# EAGLE design SerialRF1_SMD (EAGLE 7.1.0)
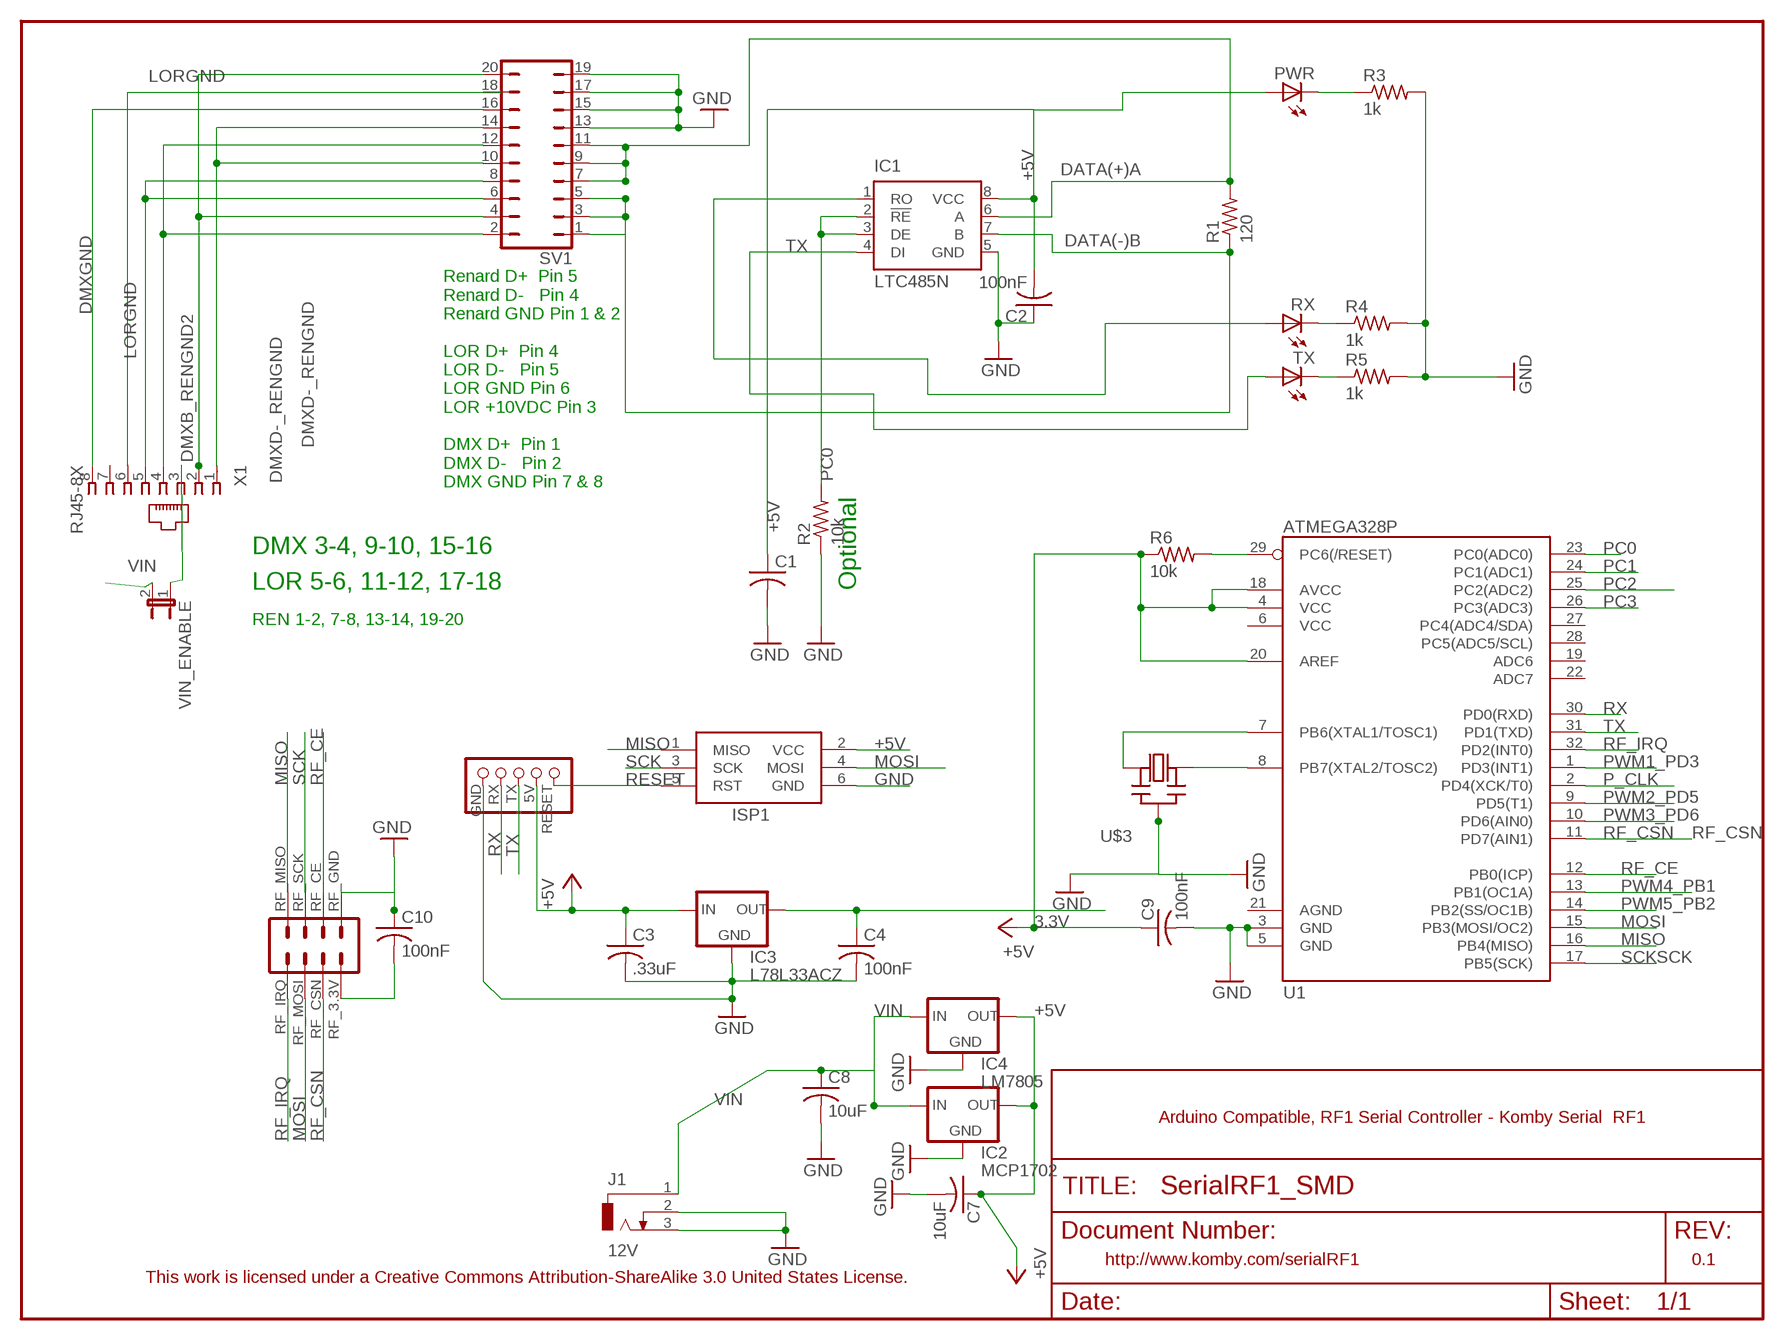
[diagram p0: schematic, sheet 1]

## Parts
C1  C-USC0805K  [C0805K]
C2  100nF  C-USC0805K  [C0805K]
C3  .33uF  C-USC0805K  [C0805K]
C4  100nF  C-USC0805K  [C0805K]
C7  10uF  C-USC0805K  [C0805K]
C8  10uF  C-USC0805K  [C0805K]
C9  100nF  C-USC0805K  [C0805K]
C10  100nF  C-USC0805K  [C0805K]
IC1  LTC485N  [DIL08]
IC2  MCP1702  MCP1700TRI  [TO92]
IC3  L78L33ACZ  78LXX  [78LXX]
IC4  LM7805  V_REG_78XXSINK  [TO220-IGO]
ISP1  AVRISP-6  [AVRISP]
J1  12V  DCJ0303  [DCJ0303]
PWR  LEDSML0805  [SML0805]
R1  120  R-US_R0805W  [R0805W]
R2  10k  R-US_R0805W  [R0805W]
R3  1k  R-US_M0805  [M0805]
R4  1k  R-US_M0805  [M0805]
R5  1k  R-US_M0805  [M0805]
R6  10k  R-US_R0805  [R0805]
RX  LEDSML0805  [SML0805]
SV1  JP10Q  [JP10Q]
TX  LEDSML0805  [SML0805]
U1  ATMEGA328P  ATMEGA328_SMT  [TQFP32-08]
U$3  CERMOSCILL-THM  [CERM_OSC]
U$4  KOMBY_TTL_SERIAL  [KOMBY_SERIAL_FOOTPRINT]
U$6  NRF24L01_HEADER  [NRF24L01]
VIN_ENABLE  JP1E  [JP1]
X1  RJ45-8X  [RJ45-NO-SHIELD]

## Nets
3.3V: C4.1 IC3.OUT
+5V: C1.1 C2.2 C3.1 C7.1 C9.1 IC1.8(VCC) IC2.3(OUT) IC3.IN IC4.OUT ISP1.2(VCC) PWR.A R6.1 U1.4(VCC) U1.18(AVCC) U1.20(AREF) U$4.5V
DATA(+)A: IC1.6(A) R1.2 SV1.7 SV1.9 SV1.11
DATA(-)B: IC1.7(B) R1.1 SV1.1 SV1.3 SV1.5
DMXB_RENGND2: SV1.4 SV1.20 X1.2
DMXD-_RENGND: SV1.10 SV1.14 X1.1
DMXGND: SV1.16 X1.8
GND: C1.2 C2.1 C3.2 C4.2 C7.2 C8.2 C9.2 C10.1 IC1.5(GND) IC2.1(GND) IC3.GND IC4.GND ISP1.6(GND) J1.2 J1.3 R2.1 R3.2 R4.2 R5.2 SV1.13 SV1.15 SV1.17 SV1.19 U1.3(GND) U1.5(GND) U$3.P$2(GND) U$4.GND U$6.RF_GND(RFGND_1)
LORGND: SV1.18 X1.6
MISO: ISP1.1(MISO) U1.16(PB4(MISO)) U$6.RF_MISO
MOSI: ISP1.4(MOSI) U1.15(PB3(MOSI/OC2)) U$6.RF_MOSI
N$1: SV1.6 SV1.8 X1.5
N$3: SV1.2 SV1.12 X1.4
N$5: VIN_ENABLE.1 X1.3
N$7: PWR.C R3.1
N$8: R4.1 RX.C
N$9: R5.1 TX.C
N$10: U1.8(PB7(XTAL2/TOSC2)) U$3.P$3(OUT)
N$11: U1.7(PB6(XTAL1/TOSC1)) U$3.P$1(IN)
N$14: C10.2 U$6.RF_3.3V
P_CLK: U1.2(PD4(XCK/T0))
PC0: IC1.2(!RE) IC1.3(DE) R2.2 U1.23(PC0(ADC0))
PC1: U1.24(PC1(ADC1))
PC2: U1.25(PC2(ADC2))
PC3: U1.26(PC3(ADC3))
PWM1_PD3: U1.1(PD3(INT1))
PWM2_PD5: U1.9(PD5(T1))
PWM3_PD6: U1.10(PD6(AIN0))
PWM4_PB1: U1.13(PB1(OC1A))
PWM5_PB2: U1.14(PB2(SS/OC1B))
RESET: ISP1.5(RST) R6.2 U1.29(PC6(/RESET)) U$4.RESET
RF_CE: U1.12(PB0(ICP)) U$6.RF_CE
RF_CSN: U1.11(PD7(AIN1)) U$6.RF_CSN
RF_IRQ: U1.32(PD2(INT0)) U$6.RF_IRQ
RX: IC1.1(RO) RX.A U1.30(PD0(RXD)) U$4.RX
SCK: ISP1.3(SCK) U1.17(PB5(SCK)) U$6.RF_SCK
TX: IC1.4(DI) TX.A U1.31(PD1(TXD)) U$4.TX
VIN: C8.1 IC2.2(IN) IC4.IN J1.1 VIN_ENABLE.2
Unconnected: U1.6(VCC) U1.19(ADC6) U1.21(AGND) U1.22(ADC7) U1.27(PC4(ADC4/SDA)) U1.28(PC5(ADC5/SCL)) X1.7

## Notes on the sheet
- Renard D+  Pin 5
  Renard D-   Pin 4
  Renard GND Pin 1 & 2
  
  LOR D+  Pin 4
  LOR D-   Pin 5
  LOR GND Pin 6
  LOR +10VDC Pin 3
  
  DMX D+  Pin 1
  DMX D-   Pin 2
  DMX GND Pin 7 & 8
- DMX 3-4, 9-10, 15-16
- LOR 5-6, 11-12, 17-18 | Optional
- REN 1-2, 7-8, 13-14, 19-20
- Arduino Compatible, RF1 Serial Controller - Komby Serial  RF1
- http://www.komby.com/serialRF1 | 0.1
- This work is licensed under a Creative Commons Attribution-ShareAlike 3.0 United States License.

## Library data of the parts
C1-C4 C7-C10 = adafruit:C-US: CAPACITOR, American symbol
IC1 = linear-technology:LTC485: Low Power RS485 Interface Transceiver Source: http://www.linear.com/pc/downloadDocument.do?navId=H0,C1,C1007,C1017,P2064,D1718; OC_FARNELL: unknown; OC_NEWARK: unknown
IC2 = adafruit:MCP1700: VOLTAGE REGULATOR
IC3 = v-reg:78LXX: VOLTAGE REGULATOR
IC4 = SparkFun-PowerIC:V_REG_78XX: Voltage Regulator Standard 7805 5V regulator. IGO (Input Ground Output). Spark Fun Electronics SKU : COM-00107
ISP1 = adafruit:AVRISP: AVR ISP HEADER Standard 6 pin header for AVR programming
J1 = con-jack_komby:DCJ0303: DC POWER JACK Source: DCJ0303.pdf; OC_FARNELL: unknown; OC_NEWARK: unknown
PWR RX TX = led:LED: LED OSRAM: - CHIPLED LG R971, LG N971, LY N971, LG Q971, LY Q971, LO R971, LY R971 LH N974, LH R974 LS Q976, LO Q976, LY Q976 LO Q996 - Hyper CHIPLED LW Q18S LB Q993, LB Q99A, LB R99A - SideLED LS A670, LO A670, LY A670, LG A670, LP A670 LB A673, LV A673, LT A673, LW A673 LH A674 LY A675 LS A676, LA A676, LO A676, LY A676, LW A676 LS A679, LY A679, LG A679 - Hyper Micro SIDELED® LS Y876, LA Y876, LO Y876, LY Y876 LT Y87S - SmartLED LW L88C, LW L88S LB L89C, LB L89S, LG L890 LS L89K, LO L89K, LY L89K LS L896, LA L896, LO L896, LY L896 - TOPLED LS T670, LO T670, LY T670, LG T670, LP T670 LSG T670, LSP T670, LSY T670, LOP T670, LYG T670 LG T671, LOG T671, LSG T671 LB T673, LV T673, LT T673, LW T673 LH T674 LS T676, LA T676, LO T676, LY T676, LB T676, LH T676, LSB T676, LW T676 LB T67C, LV T67C, LT T67C, LS T67K, LO T67K, LY T67K, LW E67C LS E67B, LA E67B, LO E67B, LY E67B, LB E67C, LV E67C, LT E67C LW T67C LS T679, LY T679, LG T679 LS T770, LO T770, LY T770, LG T770, LP T770 LB T773, LV T773, LT T773, LW T773 LH T774 LS E675, LA E675, LY E675, LS T675 LS T776, LA T776, LO T776, LY T776, LB T776 LHGB T686 LT T68C, LB T68C - Hyper Mini TOPLED® LB M676 - Mini TOPLED Santana® LG M470 LS M47K, LO M47K, LY M47K Source: http://www.osram.convergy.de LUXEON: - LUMILED® LXK2-PW12-R00, LXK2-PW12-S00, LXK2-PW14-U00, LXK2-PW14-V00 LXK2-PM12-R00, LXK2-PM12-S00, LXK2-PM14-U00 LXK2-PE12-Q00, LXK2-PE12-R00, LXK2-PE12-S00, LXK2-PE14-T00, LXK2-PE14-U00 LXK2-PB12-K00, LXK2-PB12-L00, LXK2-PB12-M00, LXK2-PB14-N00, LXK2-PB14-P00, LXK2-PB14-Q00 LXK2-PR12-L00, LXK2-PR12-M00, LXK2-PR14-Q00, LXK2-PR14-R00 LXK2-PD12-Q00, LXK2-PD12-R00, LXK2-PD12-S00 LXK2-PH12-R00, LXK2-PH12-S00 LXK2-PL12-P00, LXK2-PL12-Q00, LXK2-PL12-R00 Source: www.luxeon.com KINGBRIGHT: KA-3528ASYC Source: www.kingbright.com
R1-R6 = adafruit:R-US_: RESISTOR, American symbol
SV1 = jumper:JP10Q: JUMPER
U1 = SparkFun-DigitalIC:ATMEGA328_SMT: 32-Pin Atmega328 part Commonly used on Arduino compatible boards Available in QFP and QFN packages TQFP is IC-09069 QFN is non-stock; PROD_ID: IC-09069
U$3 = adafruit:CERMOSCILL: Ceramic oscillator with built in capacitors such as ZTT-12MHz http://www.ladyada.net/library/eagle
U$4 = komby1:KOMBY_TTL_SERIAL
U$6 = komby1:NRF24L01_HEADER: Header for the NRF24L01 8 Pin Transceivers. http://www.komby.com
VIN_ENABLE = jumper:JP1E: JUMPER
X1 = con-tycoelectronics_komby:RJ45: CORCOM Modular RJ Jacks No Shield Source: www.tycoelectronics.com .. ENG_DS_1654001_1099_RJ_L_0507.pdf; MPN: RJ45-8X; OC_FARNELL: unknown; OC_NEWARK: 16R6101

## Net classes
0 default: width 0.203 mm
1 vcc: width 0.305 mm

## Board
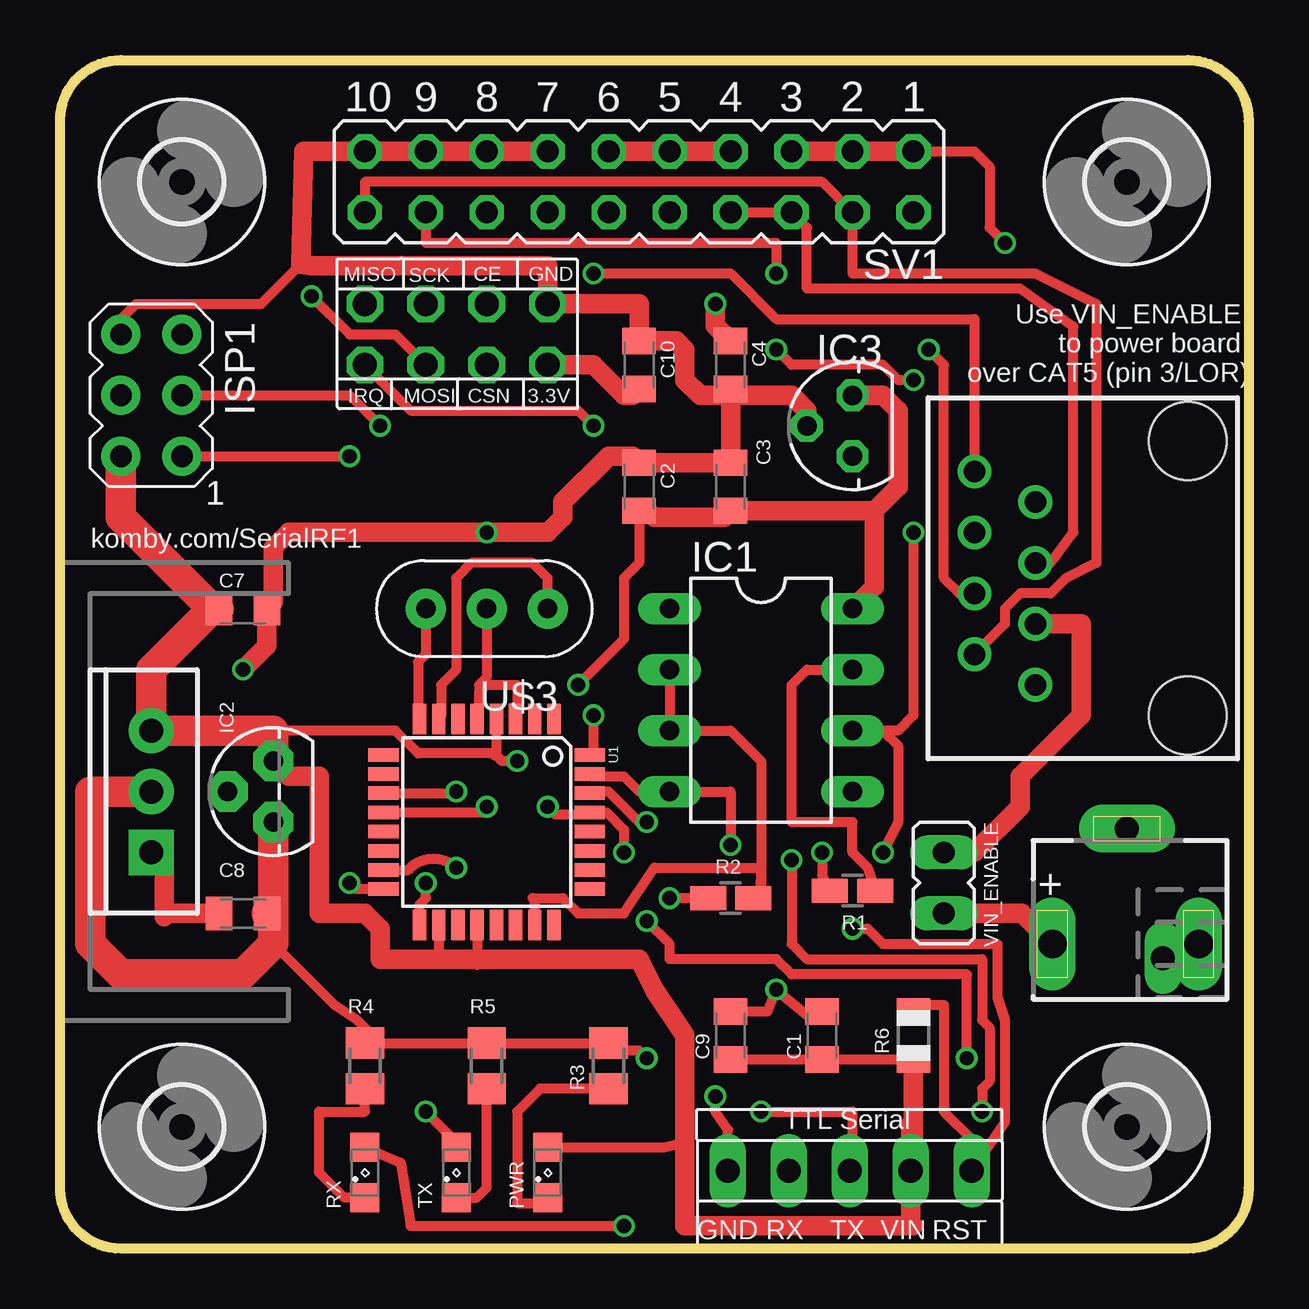
[diagram p1: board, top side]
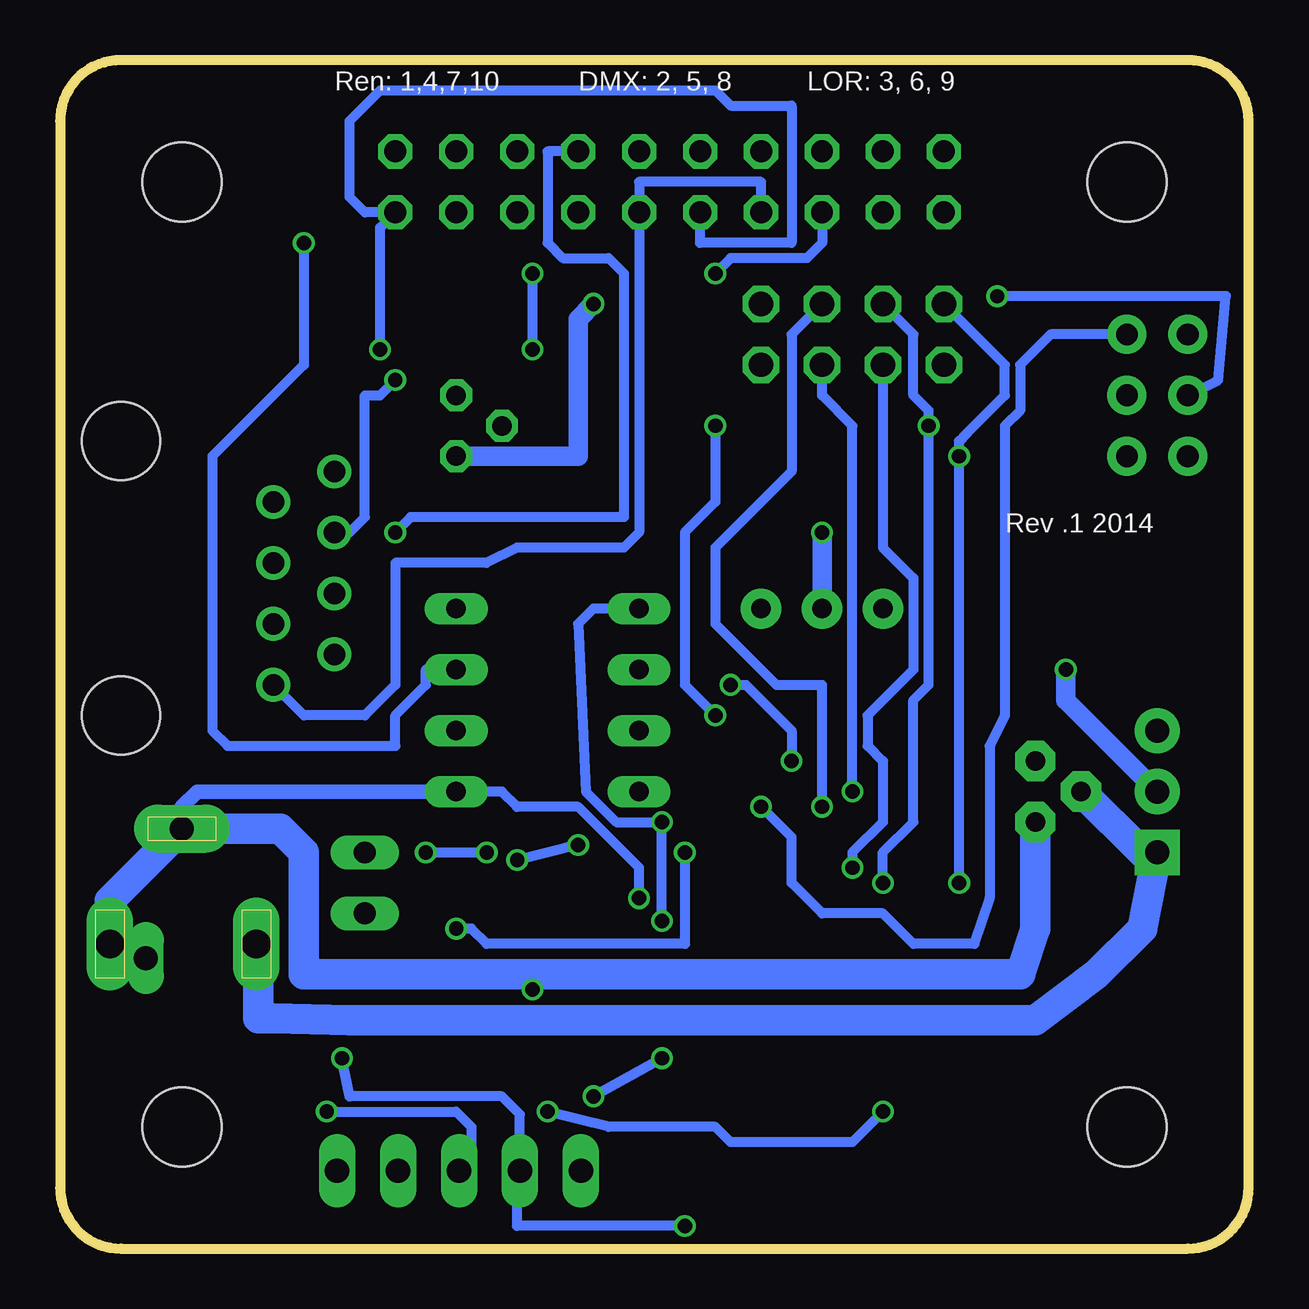
[diagram p2: board, bottom side, seen from below]

Size 49.53 x 49.53 mm. Coordinates in mm from the lower left corner, seen from the top.
Outline: 46.99,0 2.54,0 arc-90 0,2.54 0,46.99 arc-90 2.54,49.53 46.99,49.53 arc-90 49.53,46.99 49.53,2.54 arc-90 46.99,0
Copper layers (1*16): Top 0.035mm / dielectric 1.5mm / Bottom 0.035mm
Design rules "Fusion_eagle_rule_v1.1": minimum track width 6mil, minimum drill 12mil, track to track 6mil, track to pad 6mil, pad to pad 6mil, via to via 6mil, smd to smd 0mil, copper to edge 10mil, drill to drill 10mil, minimum pad ring 10mil, minimum via ring 6mil, stop-mask expansion 2mil, vias tented up to drill 100mil, thermal gap 10mil

### Footprints (pad centres in the part's own frame; a part is rotated, then mirrored left to right if it is on the bottom)
C0805K = smd 1.1 x 1.4: 1 -1,0; 2 1,0
DIL08 = drill 0.813 long: 1 -3.81,-3.81; 2 -1.27,-3.81; 3 1.27,-3.81; 4 3.81,-3.81; 5 3.81,3.81; 6 1.27,3.81; 7 -1.27,3.81; 8 -3.81,3.81
TO92 = drill 0.813 pad 1.676 octagon: 1 -1.27,0; 2 0,1.905; 3 1.27,0
78LXX = drill 0.813 octagon: GND 0,1.905; IN 1.27,0; OUT -1.27,0
TO220-IGO = drill 1 pad 1.88: GND 0,0; OUT 2.54,0 | drill 1 pad 1.88 square: IN -2.54,0
AVRISP = drill 0.9 pad 1.626: 1 -1.27,2.54; 2 1.27,2.54; 3 -1.27,0; 4 1.27,0; 5 -1.27,-2.54; 6 1.27,-2.54
DCJ0303 = drill 1.2 pad 1.93 long: 1 0,3.1; 3 0,-3 | drill 1 pad 2 long: 2 4.8,0 | drill 1 long: P$1 -0.589,-1.501
SML0805 = smd 1.2 x 1.2: A 1.05,0; C -1.05,0
R0805W = smd 1.5 x 1: 1 -0.94,0; 2 0.94,0
M0805 = smd 1.3 x 1.6: 1 -0.95,0; 2 0.95,0
R0805 = smd 1.1 x 1.4: 1 -1,0; 2 1,0
JP10Q = drill 0.914 octagon: 1 -11.43,-1.27; 2 -11.43,1.27; 3 -8.89,-1.27; 4 -8.89,1.27; 5 -6.35,-1.27; 6 -6.35,1.27; 7 -3.81,-1.27; 8 -3.81,1.27; 9 -1.27,-1.27; 10 -1.27,1.27; 11 1.27,-1.27; 12 1.27,1.27; 13 3.81,-1.27; 14 3.81,1.27; 15 6.35,-1.27; 16 6.35,1.27; 17 8.89,-1.27; 18 8.89,1.27; 19 11.43,-1.27; 20 11.43,1.27
TQFP32-08 = smd 1.27 x 0.559: 1 -4.293,2.8; 2 -4.293,2; 3 -4.293,1.2; 4 -4.293,0.4; 5 -4.293,-0.4; 6 -4.293,-1.2; 7 -4.293,-2; 8 -4.293,-2.8; 17 4.293,-2.8; 18 4.293,-2; 19 4.293,-1.2; 20 4.293,-0.4; 21 4.293,0.4; 22 4.293,1.2; 23 4.293,2; 24 4.293,2.8 | smd 0.559 x 1.27: 9 -2.8,-4.293; 10 -2,-4.293; 11 -1.2,-4.293; 12 -0.4,-4.293; 13 0.4,-4.293; 14 1.2,-4.293; 15 2,-4.293; 16 2.8,-4.293; 25 2.8,4.293; 26 2,4.293; 27 1.2,4.293; 28 0.4,4.293; 29 -0.4,4.293; 30 -1.2,4.293; 31 -2,4.293; 32 -2.8,4.293
3,3 = hole 3.3: 0,0
CERM_OSC = drill 0.813 pad 1.676: P$1 -2.54,0; P$2 0,0; P$3 2.54,0
KOMBY_SERIAL_FOOTPRINT = drill 1.016 long: 5V 3.25,3.925; GND 3.25,11.545; RESET 3.25,1.385; RX 3.25,9.005; TX 3.25,6.465
NRF24L01 = drill 1.016 octagon: RF_3.3V 2.54,-0.635; RF_CE 0,1.905; RF_CSN 0,-0.635; RF_GND 2.54,1.905; RF_IRQ -5.08,-0.635; RF_MISO -5.08,1.905; RF_MOSI -2.54,-0.635; RF_SCK -2.54,1.905
JP1 = drill 0.914 long: 1 0,-1.27; 2 0,1.27
RJ45-NO-SHIELD = drill 0.9 pad 1.4: 1 -4.445,6.35; 2 -3.175,8.89; 3 -1.905,6.35; 4 -0.635,8.89; 5 0.635,6.35; 6 1.905,8.89; 7 3.175,6.35; 8 4.445,8.89 | hole 3.251: -5.715,0; 5.715,0

### Placement (x,y rotation side)
C1  31.75,8.89 90 top
C2  24.13,31.75 270 top
C3  27.94,31.75 90 top
C4  27.94,36.83 270 top
C7  7.62,26.67 0 top
C8  7.62,13.97 0 top
C9  27.94,8.89 90 top
C10  24.13,36.83 270 top
IC1  29.21,22.86 270 top
IC2  8.89,19.05 90 top
IC3  33.02,34.29 90 top
IC4  3.81,19.05 90 top
ISP1  3.81,35.56 180 top
J1  44.45,12.7 90 top
PWR  20.32,3.17 90 top
R1  33.02,14.92 180 top
R2  27.94,14.61 0 top
R3  22.86,7.62 90 top
R4  12.7,7.62 90 top
R5  17.78,7.62 90 top
R6  35.56,8.89 90 top
RX  12.7,3.17 90 top
SV1  24.13,44.45 180 top
TX  16.51,3.17 90 top
U1  17.78,17.78 270 top
U$1  [3,3]  5.08,44.45 0 top
U$2  [3,3]  44.45,44.45 0 top
U$3  17.78,26.67 180 top
U$4  39.37,0 90 top
U$6  17.78,37.47 0 top
U$7  [3,3]  44.45,5.08 0 top
U$8  [3,3]  5.08,5.08 0 top
VIN_ENABLE  36.83,15.24 180 top
X1  46.99,27.94 90 top

### Tracks (layer width: path | path; a pad name or v marks a point on that pad's centre or on a via)
3.3V  (via drill 0.6)
  Top 0.813: v27.3,39.37 27.3,38.47 C4.1
  Bottom 0.813: IC3.OUT 27.94,33.02 27.94,38.73 v27.3,39.37
+5V  (via drill 0.6)
  Top 0.406: U1.4 18.18,20.55 | 18.18,20.55 18.1,20.55 18.1,20.64 14.92,20.64 13.97,21.59 8.89,21.59 | U1.18 15.78,12.16 15.88,12.06 | U1.20 17.38,11.83 17.78,12.06 | C9.1 C1.1 R6.1 | PWR.A 25.18,4.22 26.04,4.45 | C2.2 24.13,28.57 23.5,27.94 23.5,25.4 v21.59,23.5 | v19.05,20.32 18.41,20.32 18.18,20.55
  Top 0.813: U$4.5V 35.45,5.2 | R6.1 35.56,3.37 U$4.5V | U$4.5V 35.45,1.07 35.56,0.95 26.04,0.95 26.04,4.45 26.04,8.89 24.77,10.79 24.13,12.06 17.78,12.06 15.88,12.06 13.34,12.06 13.34,13.34 12.7,13.97 10.79,13.97 10.79,19.68 9.53,19.68 IC2.3 | 33.92,30.75 C3.1 27.67,30.48 24.77,30.48 24.5,30.75 C2.2 | 33.92,30.75 34.92,31.75 34.92,34.92 34.29,35.56 IC3.IN | 33.92,30.75 33.92,27.57 IC1.8
  Top 1.27: 6.35,26.67 3.81,24.13 IC4.OUT 8.89,21.59 IC2.3 | C7.1 6.35,26.67 | 6.35,26.67 2.54,30.48 ISP1.2
  Bottom 0.406: v21.59,23.5 20.95,23.5 19.05,21.59 v19.05,20.32
DATA(+)A  (via drill 0.6)
  Top 0.406: v35.56,29.84 35.56,22.23 34.92,21.59 IC1.6 34.29,21.59 34.92,20.95 34.92,17.78 v34.29,16.51 | v31.75,16.51 31.75,15.54 R1.2
  Top 0.813: SV1.11 SV1.9 SV1.7
  Bottom 0.406: SV1.7 29.21,45.72 29.21,41.91 28.57,41.27 26.67,41.27 26.04,40.64 26.04,30.48 34.92,30.48 v35.56,29.84 | v34.29,16.51 v31.75,16.51
DATA(-)B  (via drill 0.6)
  Top 0.406: R1.1 33.96,14.94 33.66,15.88 33.02,16.51 33.02,17.78 30.48,17.78 30.48,23.5 31.11,24.13 IC1.7 | SV1.3 38.1,45.72 38.73,45.09 38.73,42.55 v39.37,41.91
  Top 0.813: SV1.5 SV1.3 SV1.1
  Bottom 0.406: v39.37,41.91 39.37,36.83 43.18,33.02 43.18,21.59 42.55,20.95 35.56,20.95 35.56,22.23 34.29,23.5 34.29,24.13 IC1.7
DMXB_RENGND2
  Top 0.406: SV1.20 12.7,44.45 31.75,44.45 SV1.4 33.02,40.64 40.64,40.64 43.18,39.37 43.18,28.57 41.91,27.94 41.27,27.3 40.01,27.3 39.37,26.67 39.37,26.04 X1.2
DMXD-_RENGND
  Bottom 0.406: SV1.14 20.32,44.45 25.4,44.45 SV1.10 25.4,29.84 26.04,29.21 30.48,29.21 31.75,28.57 35.56,28.57 35.56,23.5 36.83,22.23 39.37,22.23 X1.1
DMXGND  (via drill 0.6)
  Top 0.406: v22.23,40.64 27.94,40.64 29.84,38.73 38.1,38.73 X1.8
  Bottom 0.406: SV1.16 17.78,41.91 18.41,41.27 21.59,41.27 v22.23,40.64
GND  (via drill 0.6)
  Top 0.406: 8.89,12.7 11.43,10.16 12.38,9.53 13.02,8.89 R4.2 R5.2 22.23,8.57 | 22.23,8.57 R3.2 | C9.2 29.48,9.89 v29.84,10.79 31.39,9.53 C1.2 | U$3.P$2 17.78,23.81 17.46,23.5 17.46,23.18 | U1.5 17.46,22.16 17.46,23.18 | 17.46,23.18 17.78,23.5 19.05,23.5 19.05,22.14 U1.3 | U$4.GND 27.82,4.96 27.3,5.71 v27.3,6.35 | v24.45,7.94 24.13,8.26 22.54,8.26 22.23,8.57 | ISP1.6 2.54,38.73 3.17,39.37 8.38,39.37 10.03,41.02 | R2.1 v25.4,14.61
  Top 0.813: v7.62,24.13 8.62,25.13 C7.2 8.89,26.94 8.89,29.21 9.53,29.84 v17.78,29.84 20.32,29.84 20.95,30.48 20.95,31.11 22.86,33.02 23.86,33.02 C2.1 C3.2 C4.2 | C4.2 27.67,35.56 26.67,35.56 26.04,36.2 26.04,37.47 25.67,37.83 C10.1 24.13,39.37 U$6.RF_GND 20.32,40.96 10.48,40.96 10.03,41.02 10.16,45.72 SV1.19 SV1.17 SV1.15 SV1.13 | IC3.GND 31.11,34.92 30.48,35.56 28.21,35.56 C4.2
  Top 1.27: IC4.GND 1.27,19.05 1.27,12.7 2.54,11.43 7.62,11.43 8.89,12.7 8.89,13.97 | 8.89,13.97 IC2.1 | C8.2 8.89,13.97
  Bottom 0.406: v29.84,10.79 29.84,11.43 | v27.3,6.35 v24.45,7.94 | v25.4,14.61 25.4,15.88 27.94,18.41 30.48,18.41 31.11,19.05 IC1.5
  Bottom 0.61: IC1.5 43.81,19.05 44.45,18.41 J1.2
  Bottom 0.813: v7.62,24.13 7.62,22.86 IC4.GND | U$3.P$2 v17.78,29.84
  Bottom 1.27: J1.3 47.45,14.5 J1.2 40.36,17.5 39.37,16.51 39.37,11.43 29.84,11.43 9.53,11.43 8.89,13.34 IC2.1
LORGND  (via drill 0.6)
  Top 0.406: SV1.18 15.24,41.91 29.84,41.91 v29.84,40.64 | v35.56,36.2 34.92,36.2 34.29,36.83 30.48,36.83 v29.84,37.47
  Bottom 0.406: X1.6 37.47,29.84 36.83,30.48 36.83,35.56 36.2,35.56 v35.56,36.2 | v29.84,40.64 v29.84,37.47
MISO  (via drill 0.6)
  Top 0.406: U1.16 12.32,14.98 v12.06,15.24 | ISP1.1 v12.06,33.02
  Bottom 0.406: v12.06,15.24 v12.06,33.02 12.06,33.66 11.75,33.97 10.16,35.56 10.16,36.83 U$6.RF_MISO
MOSI  (via drill 0.6)
  Top 0.406: U1.15 14.51,15.78 arc-90 v16.51,15.88 | v10.48,39.69 12.06,38.1 13.97,38.1 U$6.RF_MOSI
  Bottom 0.406: ISP1.4 1.27,36.2 0.95,39.69 v10.48,39.69 | U$6.RF_MOSI 15.24,29.21 13.97,27.94 13.97,24.13 15.88,22.23 15.88,20.95 15.24,20.32 15.24,17.78 16.51,16.51 v16.51,15.88
N$1
  Top 0.406: X1.5 41.27,28.57 42.23,29.84 42.23,38.42 40.01,40.01 31.11,40.01 31.11,42.55 SV1.6 SV1.8
N$3  (via drill 0.6)
  Top 0.406: X1.4 37.47,27.3 36.83,27.94 36.83,36.83 v36.2,37.47
  Bottom 0.406: v36.2,37.47 36.2,42.55 SV1.2 36.83,43.18 37.47,43.81 37.47,46.99 36.2,48.26 22.23,48.26 21.59,47.62 19.05,47.62 19.05,41.91 22.86,41.91 SV1.12
N$5
  Top 0.813: VIN_ENABLE.1 38.1,16.51 40.01,18.41 40.01,19.68 42.55,22.23 42.55,26.04 X1.3
N$7
  Top 0.406: R3.1 20,6.67 19.05,5.71 19.05,1.91 20.1,1.91 PWR.C
N$8
  Top 0.406: RX.C 11.85,2.12 10.79,3.17 10.79,5.71 12.7,5.71 R4.1
N$9
  Top 0.406: TX.C 17.36,2.12 17.78,2.54 R5.1
N$10
  Top 0.406: U$3.P$3 15.24,24.77 14.92,24.45 14.92,22.13 U1.8
N$11
  Top 0.406: U$3.P$1 20.32,27.94 19.68,28.57 17.14,28.57 16.51,27.94 16.51,24.13 15.88,23.5 15.88,22.17 U1.7
N$14
  Top 0.813: U$6.RF_3.3V 22.23,36.83 23.5,35.56 23.86,35.56 C10.2
PC0
  Top 0.406: 29.21,15.88 29.2,14.91 R2.2 29.21,14.3 29.21,15.88 | IC1.2 IC1.3 27.94,21.59 29.21,20.32 29.21,15.88 | U1.23 19.78,14.51 19.68,14.61 20.95,14.61 21.59,13.97 23.5,13.97 24.77,15.88 29.21,15.88
RESET  (via drill 0.6)
  Top 0.406: 36.2,10.16 R6.2 35.2,9.89 36.2,10.16 | 36.2,10.16 36.83,10.16 36.83,5.71 37.98,4.56 U$4.RESET 39.37,5.27 39.37,9.53 39.05,10.48 39.05,12.7 34.29,12.7 33.66,13.34 v33.02,13.34 | v20.32,18.41 20.64,18.1 21.99,18.1 U1.29 22.78,18.18 23.5,17.46 v23.5,16.51
  Bottom 0.406: ISP1.5 8.26,38.1 9.53,36.83 9.53,34.92 10.16,34.29 10.16,22.23 10.79,20.95 10.79,14.61 11.43,12.7 13.97,12.7 15.24,13.97 17.78,13.97 19.05,15.24 19.05,17.14 v20.32,18.41 | v23.5,16.51 23.5,12.7 31.75,12.7 32.38,13.34 v33.02,13.34
RF_CE  (via drill 0.6)
  Top 0.406: U1.12 17.55,18.18 v17.78,18.41
  Bottom 0.406: v17.78,18.41 17.78,23.5 19.68,23.5 22.23,26.04 22.23,29.21 19.05,32.38 19.05,38.1 U$6.RF_CE
RF_CSN  (via drill 0.6)
  Top 0.406: U1.11 16.44,18.98 v16.51,19.05
  Bottom 0.406: v16.51,19.05 16.51,34.29 17.78,35.56 U$6.RF_CSN
RF_IRQ  (via drill 0.6)
  Top 0.406: U$6.RF_IRQ 14.61,34.92 21.59,34.92 v22.23,34.29 | v22.23,22.23 22.23,20.73 U1.32
  Bottom 0.406: v22.23,34.29 22.23,31.11 23.5,29.84 23.5,23.5 v22.23,22.23
RX  (via drill 0.6)
  Top 0.406: RX.A 14.19,3.59 14.61,0.95 v23.5,0.95 | v24.45,17.78 24.13,17.78 22.86,19.05 22.14,19.05 U1.30 | v37.78,7.94 37.78,11.43 30.48,11.43 29.84,12.06 25.4,12.06 25.4,12.7 v24.45,13.65
  Bottom 0.406: v23.5,0.95 30.48,0.95 30.48,3.13 U$4.RX 30.36,5.6 31.11,6.35 37.47,6.35 v37.78,7.94 | IC1.1 27.3,26.67 27.94,26.04 27.62,19.05 26.35,17.78 v24.45,17.78 v24.45,13.65
SCK  (via drill 0.6)
  Top 0.406: U1.17 14.98,14.35 15.24,14.61 v15.24,15.24 | ISP1.3 12.06,35.56 v13.34,34.29
  Bottom 0.406: v15.24,15.24 15.24,16.51 13.97,17.78 13.97,22.86 13.34,23.5 v13.34,34.29 13.34,34.92 13.97,35.56 13.97,38.1 U$6.RF_SCK
TX  (via drill 0.6)
  Top 0.406: U1.31 22.17,19.68 23.5,19.68 24.13,19.05 IC1.4 27.94,19.05 v27.94,16.83 | v30.48,16.19 30.48,12.7 31.11,12.06 38.42,12.06 38.42,9.53 38.73,9.21 38.73,6.99 38.42,6.67 v38.42,5.71 | TX.A 16.51,4.45 v15.24,5.71 | v29.21,5.71 33.02,5.71 33.02,3.37 U$4.TX
  Bottom 0.406: v27.94,16.83 v30.48,16.19 | v38.42,5.71 33.02,5.71 32.38,5.08 32.38,3.77 U$4.TX | v15.24,5.71 16.51,4.45 21.59,4.45 22.23,5.08 26.67,5.08 v29.21,5.71
VIN
  Top 0.813: VIN_ENABLE.2 40.08,13.97 J1.1 | C8.1 4.49,13.97 4.35,13.82 4.35,15.97 IC4.IN
  Bottom 1.27: J1.1 41.27,12.06 41.27,9.6 40.72,9.6 37.47,9.53 8.89,9.53 6.35,11.43 4.45,13.34 IC4.IN 4.45,16.51 IC2.2

### Text on the board
tNames: Use VIN_ENABLE / to power board / over CAT5 (pin 3/LOR) | komby.com/SerialRF1
bNames: LOR: 3, 6, 9 | DMX: 2, 5, 8 | Ren: 1,4,7,10 | Rev .1 2014